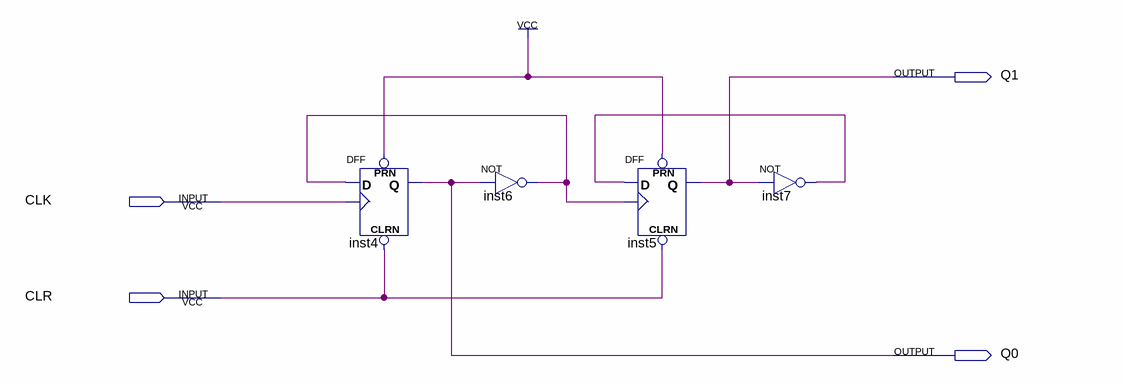
[diagram p0: schematic sheet]
// Quartus schematic MOD4.bdf as structural Verilog: 4 symbols, 4 pins
module MOD4 (
  input  CLK,
  input  CLR,
  output Q1,
  output Q0
);

  wire inst6_out, inst7_out;

  DFF inst4 (.CLRN(CLR), .CLK(CLK), .D(inst6_out), .PRN(1'b1), .Q(Q0));
  not inst6 (inst6_out, Q0);
  DFF inst5 (.CLRN(CLR), .CLK(inst6_out), .D(inst7_out), .PRN(1'b1), .Q(Q1));
  not inst7 (inst7_out, Q1);
endmodule
